# Altium schematic sheet Touch_sensors.SchDoc
size A4; SheetNumber: 6; SheetTotal: 6
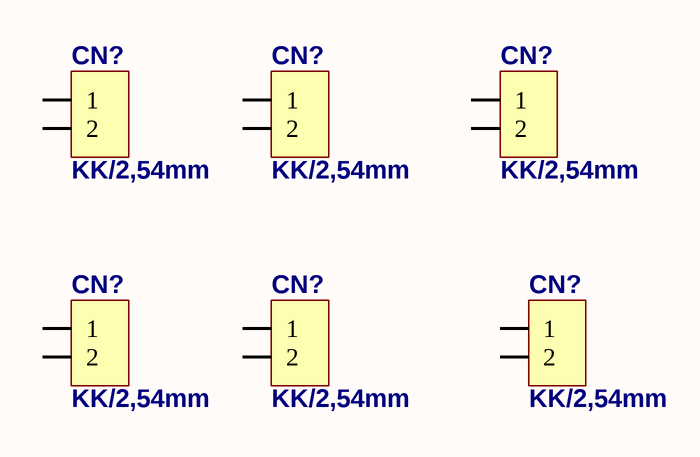
[diagram p0: Touch_sensors.SchDoc]

## Parts
(Parts that share a designator on the sheet are numbered #1, #2 ... from top to bottom, then left to right.)
CN?#1  KK/2,54mm  [KK/2.54/2]
CN?#2  KK/2,54mm  [KK/2.54/2]
CN?#3  KK/2,54mm  [KK/2.54/2]
CN?#4  KK/2,54mm  [KK/2.54/2]
CN?#5  KK/2,54mm  [KK/2.54/2]
CN?#6  KK/2,54mm  [KK/2.54/2]

## Nets

Not connected (* = marked no-connect by the designer): CN?#1 1 2; CN?#2 1 2; CN?#3 1 2; CN?#4 1 2; CN?#5 1 2; CN?#6 1 2

## Library data of the parts
CN?#1-CN?#6 = CN_2x1: Connector: PCB-cable; KK; socket; male; PIN:2; straight/right-angle; tinned; THT